# EAGLE design rgb-led-board (EAGLE 7.4.0)
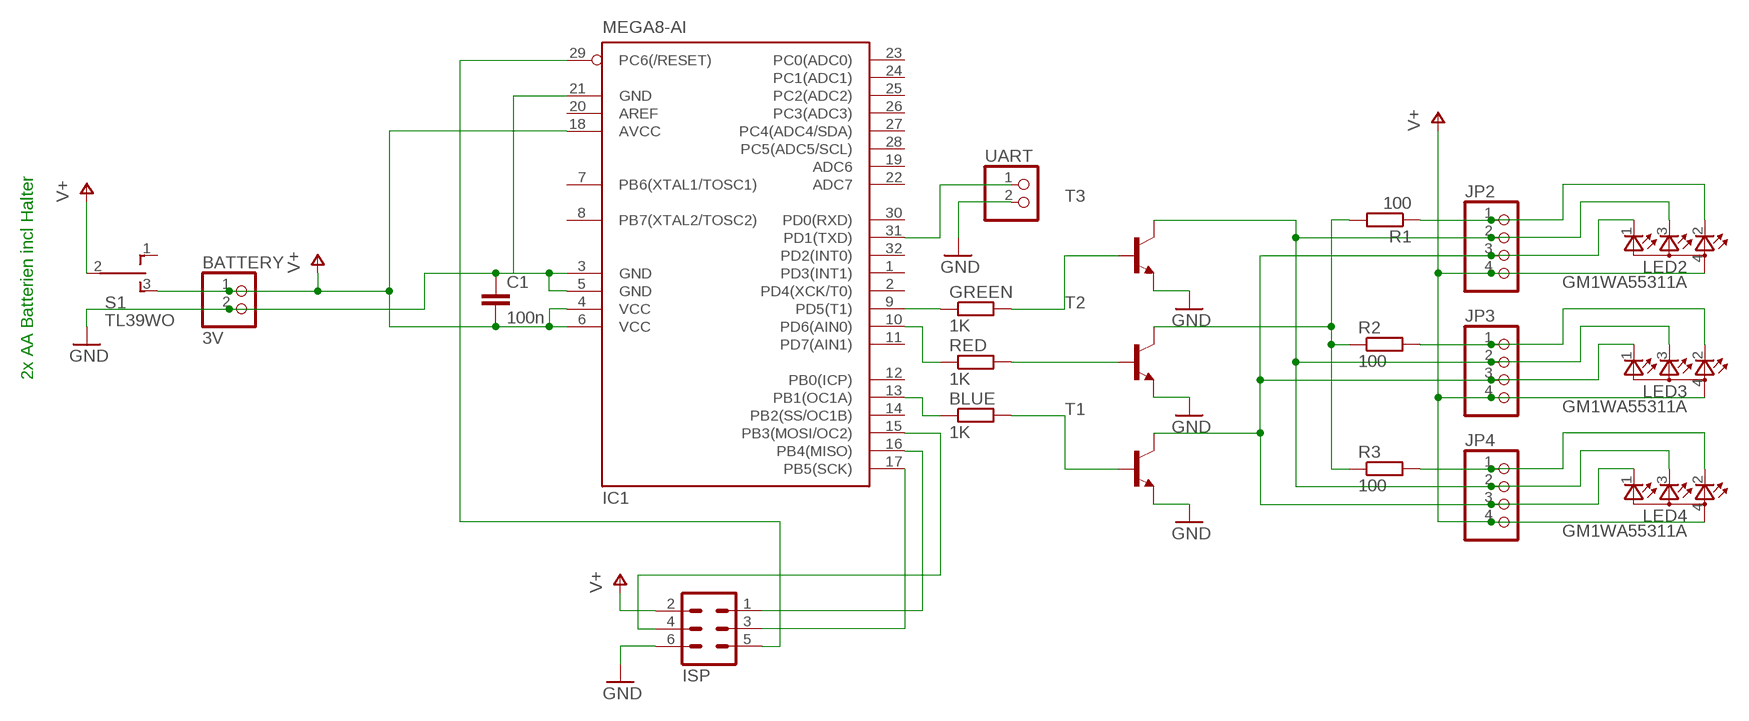
[diagram p0: schematic, sheet 1]

## Parts
BATTERY  3V  PINHD-1X2  [1X02]
BLUE  1K  R-EU_R1206  [R1206]
C1  100n  C-EUC1206  [C1206]
GREEN  1K  R-EU_R1206  [R1206]
IC1  MEGA8-AI  [TQFP32-08]
ISP  ML6  [ML6]
JP2  PINHD-1X4  [1X04]
JP3  PINHD-1X4  [1X04]
JP4  PINHD-1X4  [1X04]
LED2  GM1WA55311A  [GM1WA55311A]
LED3  GM1WA55311A  [GM1WA55311A]
LED4  GM1WA55311A  [GM1WA55311A]
R1  100  R-EU_R1206  [R1206]
R2  100  R-EU_R1206  [R1206]
R3  100  R-EU_R1206  [R1206]
RED  1K  R-EU_R1206  [R1206]
S1  TL39WO  [TL3XWO]
T1  BC817-16-NPN-SOT23-BEC  [SOT23-BEC]
T2  BC817-16-NPN-SOT23-BEC  [SOT23-BEC]
T3  BC817-16-NPN-SOT23-BEC  [SOT23-BEC]
UART  PINHD-1X2  [1X02]

## Nets
GND: BATTERY.2 C1.1 IC1.3(GND) IC1.5(GND) IC1.21(GND) ISP.6 T1.E T2.E T3.E UART.2
N$9: GREEN.1 IC1.9(PD5(T1))
N$10: IC1.10(PD6(AIN0)) RED.1
N$11: BLUE.1 IC1.13(PB1(OC1A))
N$12: RED.2 T2.B
N$13: GREEN.2 T3.B
N$14: BLUE.2 T1.B
N$15: JP2.1 LED2.2(CRED) R1.1
N$16: JP3.1 LED3.2(CRED) R2.2
N$17: JP4.1 LED4.2(CRED) R3.2
N$18: JP2.2 JP3.2 JP4.2 LED2.3(CBLUE) LED3.3(CBLUE) LED4.3(CBLUE) T3.C
N$19: R1.2 R2.1 R3.1 T2.C
N$20: JP2.3 JP3.3 JP4.3 LED2.1(CGREEN) LED3.1(CGREEN) LED4.1(CGREEN) T1.C
N$21: IC1.31(PD1(TXD)) UART.1
N$23: IC1.16(PB4(MISO)) ISP.1
N$24: IC1.17(PB5(SCK)) ISP.3
N$25: IC1.29(PC6(/RESET)) ISP.5
N$26: IC1.15(PB3(MOSI/OC2)) ISP.4
V+: BATTERY.1 C1.2 IC1.4(VCC) IC1.6(VCC) IC1.18(AVCC) ISP.2 JP2.4 JP3.4 JP4.4 LED2.4(A) LED3.4(A) LED4.4(A) S1.2(P) S1.3(S)
Unconnected: IC1.1(PD3(INT1)) IC1.2(PD4(XCK/T0)) IC1.7(PB6(XTAL1/TOSC1)) IC1.8(PB7(XTAL2/TOSC2)) IC1.11(PD7(AIN1)) IC1.12(PB0(ICP)) IC1.14(PB2(SS/OC1B)) IC1.19(ADC6) IC1.20(AREF) IC1.22(ADC7) IC1.23(PC0(ADC0)) IC1.24(PC1(ADC1)) IC1.25(PC2(ADC2)) IC1.26(PC3(ADC3)) IC1.27(PC4(ADC4/SDA)) IC1.28(PC5(ADC5/SCL)) IC1.30(PD0(RXD)) IC1.32(PD2(INT0)) S1.1(O)

## Notes on the sheet
- 2x AA Batterien incl Halter

## Library data of the parts
BATTERY UART = pinhead:PINHD-1X2: PIN HEADER
BLUE GREEN R1-R3 RED = rcl:R-EU_: RESISTOR, European symbol
C1 = rcl:C-EU: CAPACITOR, European symbol
IC1 = atmel:MEGA8: MICROCONTROLLER 8 Kbytes FLASH, 1 kbytes SRAM, 512 bytes EEPROM, USART, 6-channel 10 bit ADC, 2-channel 8 bit ADC Pin compatible with Atmega48, ATMega88, ATMega168 Source: avr.lbr; MPN: ATMEGA8-16AU; OC_FARNELL: 9171371; OC_NEWARK: 73M8863
ISP = con-ml:ML6: HARTING; OC_FARNELL: unknown; OC_NEWARK: unknown
JP2-JP4 = pinhead:PINHD-1X4: PIN HEADER
LED2-LED4 = led:GM1WA55311A: Chip LED RGB Source: http://document.sharpsma.com/files/GM1WA55311A_SS.pdf
S1 = switch:TL39WO: TINY SWITCH ON OFF ON Source: http://www2.produktinfo.conrad.com/datenblaetter/700000-724999/705152-da-01-de-Subminiaturschalter_TL_36WO.pdf
T1-T3 = transistor:*-NPN-: NPN Transistror BF959 corrected 2008.03.06

## Board
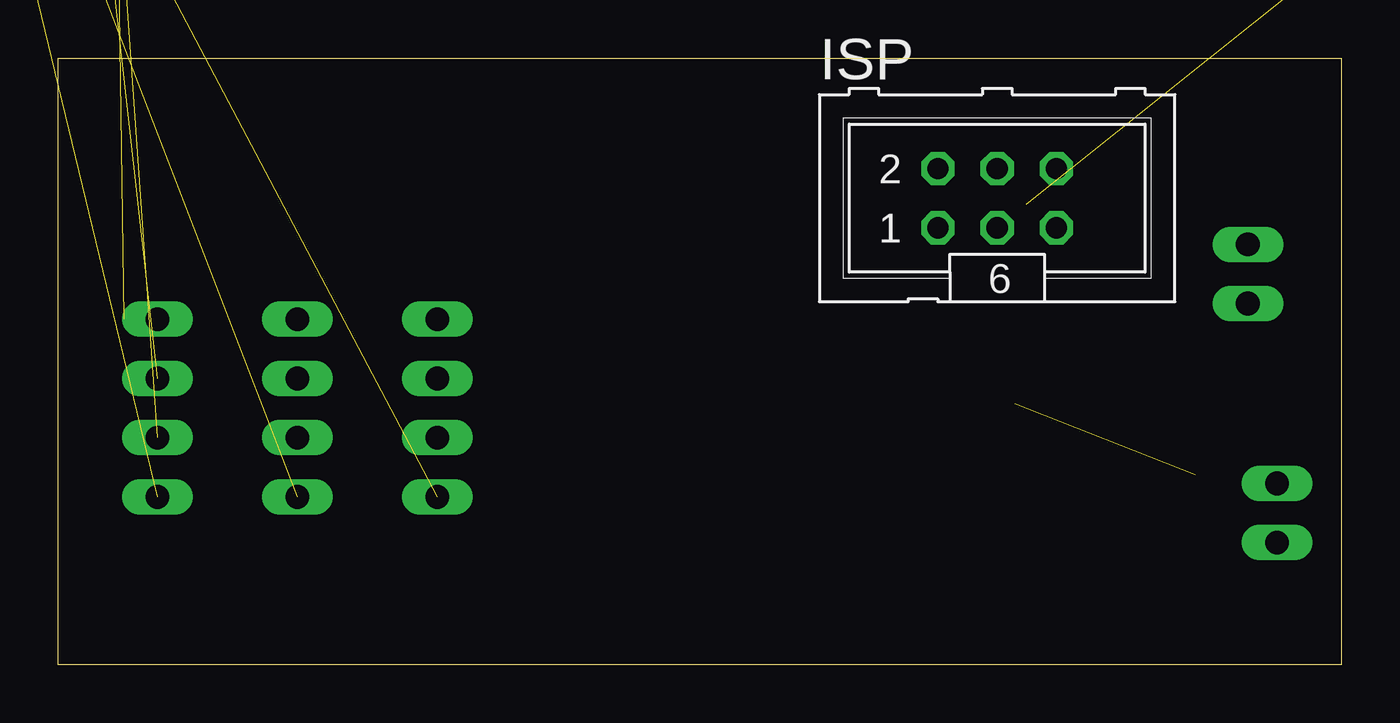
[diagram p1: board, top side]
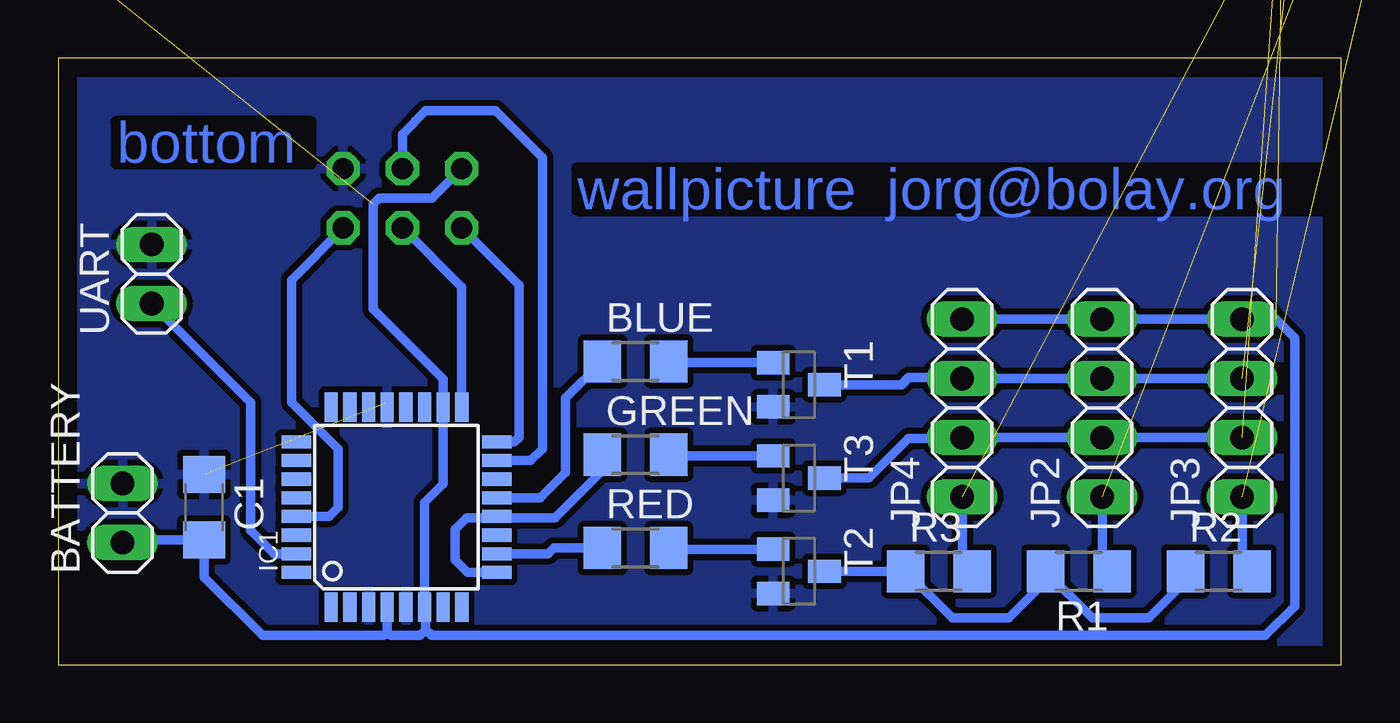
[diagram p2: board, bottom side, seen from below]

Size 55 x 26 mm. Coordinates in mm from the lower left corner, seen from the top.
Outline: 55,0 0,0 0,26 55,26 55,0
Copper layers (1*16): Top 0.035mm / dielectric 1.5mm / Bottom 0.035mm
Design rules "default *": minimum track width 10mil, minimum drill 0.8mm, track to track 10mil, track to pad 10mil, pad to pad 10mil, via to via 10mil, smd to smd 10mil, copper to edge 0.8mm, drill to drill 0.4mm, minimum pad ring 10mil, minimum via ring 8mil, stop-mask expansion 4mil, vias tented up to drill 0mil, thermal gap 10mil

### Footprints (pad centres in the part's own frame; a part is rotated, then mirrored left to right if it is on the bottom)
1X02 = drill 1.016 long: 1 -1.27,0; 2 1.27,0
R1206 = smd 1.6 x 1.803: 1 -1.422,0; 2 1.422,0
C1206 = smd 1.6 x 1.8: 1 -1.4,0; 2 1.4,0
TQFP32-08 = smd 1.27 x 0.559: 1 -4.293,2.8; 2 -4.293,2; 3 -4.293,1.2; 4 -4.293,0.4; 5 -4.293,-0.4; 6 -4.293,-1.2; 7 -4.293,-2; 8 -4.293,-2.8; 17 4.293,-2.8; 18 4.293,-2; 19 4.293,-1.2; 20 4.293,-0.4; 21 4.293,0.4; 22 4.293,1.2; 23 4.293,2; 24 4.293,2.8 | smd 0.559 x 1.27: 9 -2.8,-4.293; 10 -2,-4.293; 11 -1.2,-4.293; 12 -0.4,-4.293; 13 0.4,-4.293; 14 1.2,-4.293; 15 2,-4.293; 16 2.8,-4.293; 25 2.8,4.293; 26 2,4.293; 27 1.2,4.293; 28 0.4,4.293; 29 -0.4,4.293; 30 -1.2,4.293; 31 -2,4.293; 32 -2.8,4.293
ML6 = drill 0.914 octagon: 1 -2.54,-1.27; 2 -2.54,1.27; 3 0,-1.27; 4 0,1.27; 5 2.54,-1.27; 6 2.54,1.27
1X04 = drill 1.016 long: 1 -3.81,0; 2 -1.27,0; 3 1.27,0; 4 3.81,0
GM1WA55311A = smd 0.65 x 1.2: 1 -0.475,0.9; 2 -0.475,-0.9; 3 0.475,-0.9; 4 0.475,0.9
TL3XWO = drill 1.1 pad 1.422 long: 1 -2.54,-5.08; 2 0,-5.08; 3 2.54,-5.08 | drill 1.1 pad 1.676: M1 -2.54,0; M2 2.54,0
SOT23-BEC = smd 1 x 1.4: B -0.95,-1.1; C 0,1.1; E 0.95,-1.1

### Placement (x,y rotation side)
BATTERY  52.25,6.5 90 bottom
BLUE  30.25,13 0 bottom
C1  48.75,6.75 270 bottom
GREEN  30.25,9 0 bottom
IC1  40.5,6.75 90 bottom
ISP  40.25,20 0 top
JP2  10.25,11 90 bottom
JP3  4.25,11 90 bottom
JP4  16.25,11 90 bottom
LED2  0,36 0 top  (outside the outline)
LED3  -2,36 0 top  (outside the outline)
LED4  2,36 0 top  (outside the outline)
R1  11.25,4 180 bottom
R2  5.25,4 0 bottom
R3  17.25,4 0 bottom
RED  30.25,5 0 bottom
S1  70,41 270 top  (outside the outline)
T1  23.25,12 270 bottom
T2  23.25,4 270 bottom
T3  23.25,8 270 bottom
UART  51,16.75 90 bottom

### Tracks (layer width: path | path; a pad name or v marks a point on that pad's centre or on a via)
GND  (1 unrouted)
  Bottom 0.406: 41,11.19 IC1.21
  pour Bottom: 56,-1 -1,-1 -1,27 56,27
N$9
  Bottom 0.406: IC1.9 37.45,3.95 38,4.5 38,5.8 37.5,6.3 33.7,6.3 31.75,8.25 31.75,8.92 GREEN.1
N$10
  Bottom 0.406: RED.1 33.75,5 34,4.75 IC1.10
N$11
  Bottom 0.406: IC1.13 34.35,7.15 33.25,8.25 33.25,11.42 BLUE.1
N$12
  Bottom 0.406: T2.B 28.78,4.95 RED.2
N$13
  Bottom 0.406: T3.B 28.78,8.95 GREEN.2
N$14
  Bottom 0.406: T1.B 28.78,12.95 BLUE.2
N$15  (1 unrouted)
  Bottom 0.406: JP2.1 10.25,4.42 R1.1
N$16  (1 unrouted)
  Bottom 0.406: JP3.1 4.25,4.42 R2.2
N$17  (1 unrouted)
  Bottom 0.406: JP4.1 16.25,4.42 R3.2
N$18  (3 unrouted)
  Bottom 0.406: JP3.2 JP2.2 JP4.2 16.28,9.7 18.55,9.7 20.25,8 T3.C
N$19
  Bottom 0.406: R2.1 6.67,3.58 8.25,2 10.67,2 R1.2 12.67,3.58 14.25,2 16.67,2 R3.1 T2.C
N$20  (3 unrouted)
  Bottom 0.406: T1.C 18.85,12 18.55,12.3 16.28,12.3 JP4.3 JP2.3 JP3.3
N$21
  Bottom 0.406: IC1.31 45.75,4.75 46.75,5.75 46.75,11.23 UART.1
N$23
  Bottom 0.406: IC1.16 35.45,9.55 35.25,9.75 35.25,16.27 ISP.1
N$24
  Bottom 0.406: IC1.17 37.7,16.18 ISP.3
N$25
  Bottom 0.406: ISP.5 42.79,18.71 45,16.5 45,11.25 43,9.25 43,6.75 43.4,6.35 IC1.29
N$26
  Bottom 0.406: IC1.15 34.75,8.75 34.25,9.25 34.25,21.75 36.25,23.75 39.25,23.75 40.25,22.75 ISP.4
V+  (5 unrouted)
  Bottom 0.406: JP4.4 JP2.4 JP3.4 2.81,14.81 2,14 2,2.5 3.25,1.25 39,1.25 39.25,1.5 | BATTERY.1 52.88,5.35 C1.2 48.75,3.75 46.25,1.25 41.05,1.25 40.9,1.4 | 39.25,1.5 39.25,2.41 IC1.6 39.3,6.95 38.5,7.75 IC1.18 38.5,12.25 41.5,15.25 41.5,19.75 41.25,20 38.98,20 ISP.2 | IC1.4 40.9,1.4 | 40.9,1.4 40.75,1.25 39.5,1.25 39.25,1.5

### Text on the board
Bottom: bottom | jorg@bolay.org | wallpicture